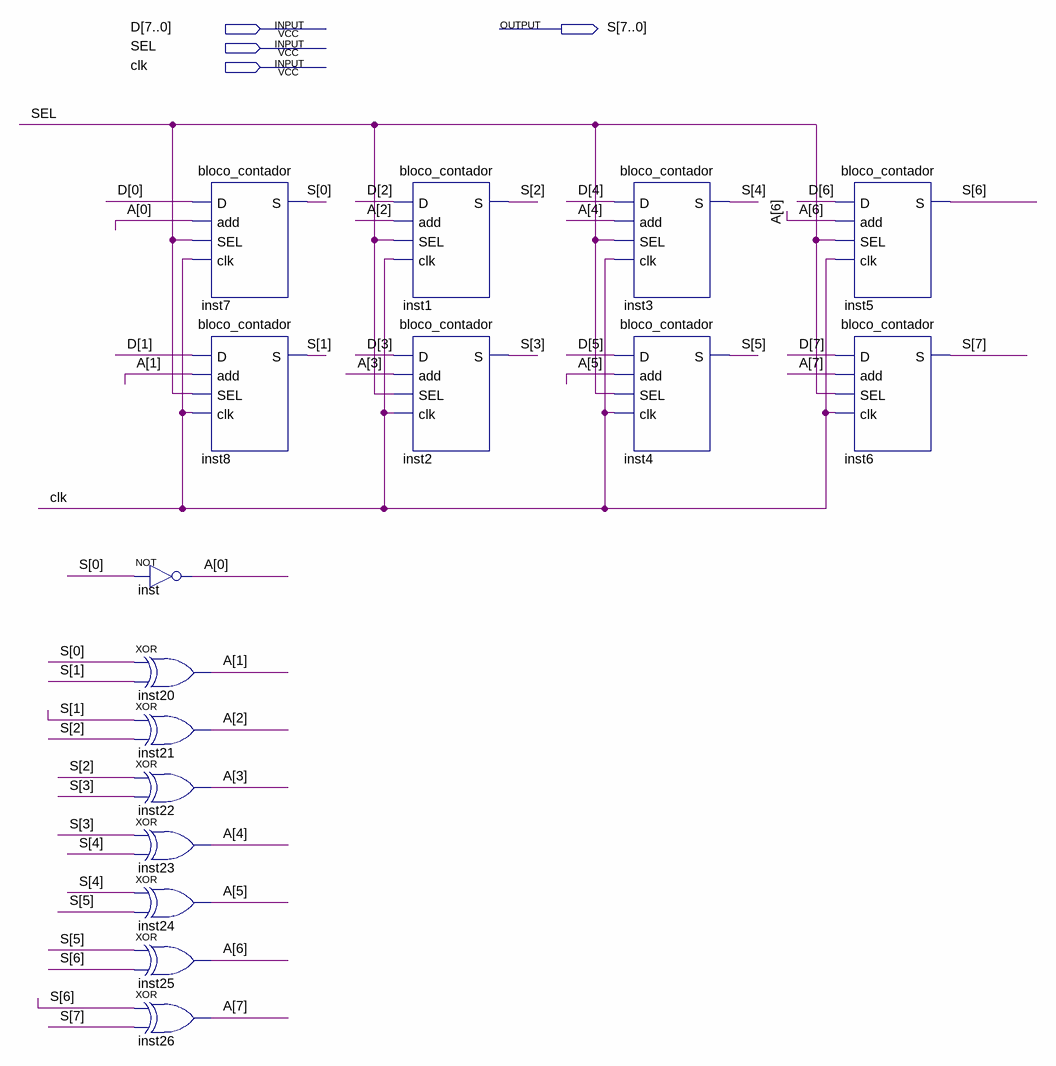
[diagram p0: schematic sheet]
// Quartus schematic contador_8bits.bdf as structural Verilog: 16 symbols, 4 pins
module contador_8bits (
  input  [7:0] D,
  input  SEL,
  input  clk,
  output [7:0] S
);

  wire [7:0] A;

  not inst (A[0], S[0]);
  xor inst20 (A[1], S[0], S[1]);
  xor inst21 (A[2], S[1], S[2]);
  xor inst22 (A[3], S[2], S[3]);
  xor inst23 (A[4], S[3], S[4]);
  xor inst24 (A[5], S[4], S[5]);
  xor inst25 (A[6], S[5], S[6]);
  xor inst26 (A[7], S[6], S[7]);
  bloco_contador inst7 (.D(D[0]), .add(A[0]), .SEL(SEL), .clk(clk), .S(S[0]));
  bloco_contador inst8 (.D(D[1]), .add(A[1]), .SEL(SEL), .clk(clk), .S(S[1]));
  bloco_contador inst1 (.D(D[2]), .add(A[2]), .SEL(SEL), .clk(clk), .S(S[2]));
  bloco_contador inst2 (.D(D[3]), .add(A[3]), .SEL(SEL), .clk(clk), .S(S[3]));
  bloco_contador inst3 (.D(D[4]), .add(A[4]), .SEL(SEL), .clk(clk), .S(S[4]));
  bloco_contador inst4 (.D(D[5]), .add(A[5]), .SEL(SEL), .clk(clk), .S(S[5]));
  bloco_contador inst5 (.D(D[6]), .add(A[6]), .SEL(SEL), .clk(clk), .S(S[6]));
  bloco_contador inst6 (.D(D[7]), .add(A[7]), .SEL(SEL), .clk(clk), .S(S[7]));
endmodule
